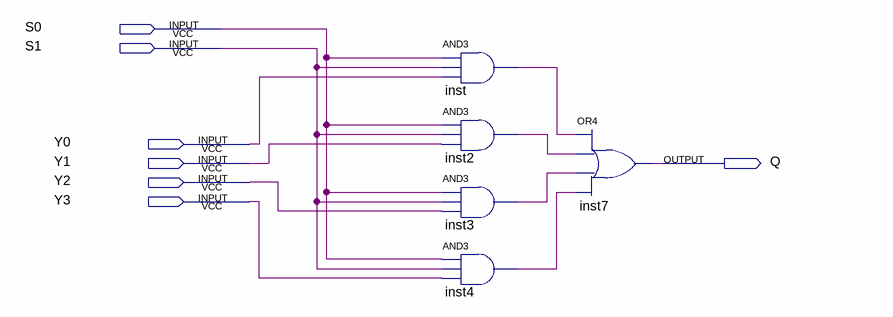
[diagram p0: schematic sheet]
// Quartus schematic mux.bdf as structural Verilog: 5 symbols, 7 pins
module mux (
  input  S0,
  input  S1,
  input  Y0,
  input  Y1,
  input  Y2,
  input  Y3,
  output Q
);

  wire inst2_out, inst3_out, inst4_out, inst_out;

  and inst (inst_out, S0, S1, Y0);
  and inst2 (inst2_out, S0, S1, Y1);
  and inst3 (inst3_out, S0, S1, Y2);
  and inst4 (inst4_out, S0, S1, Y3);
  or inst7 (Q, inst_out, inst2_out, inst3_out, inst4_out);
endmodule
